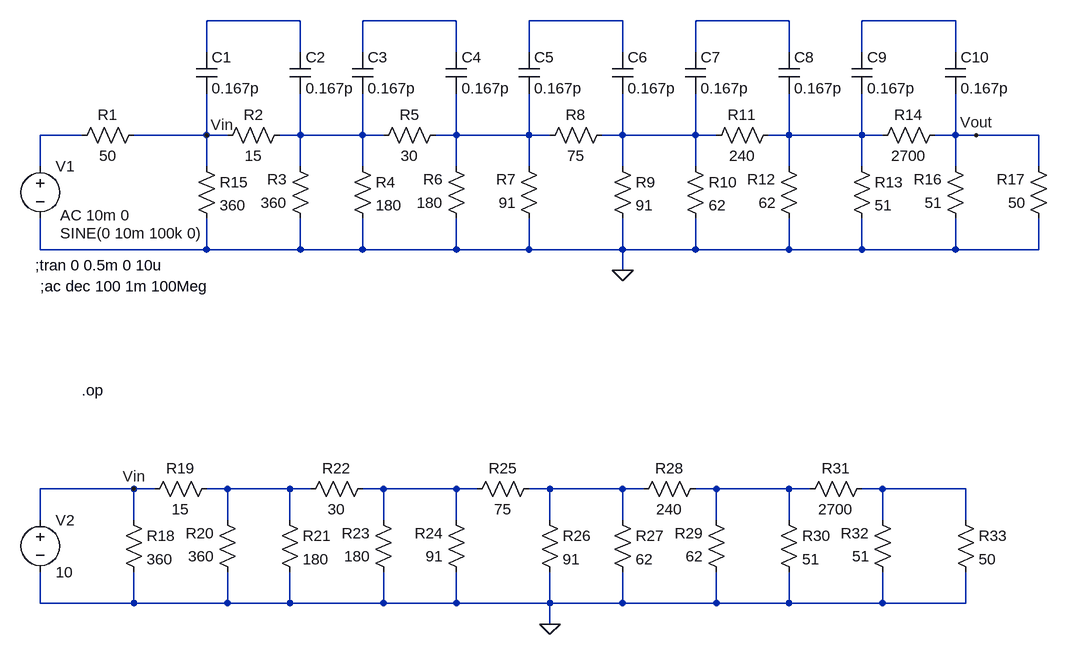
[diagram p0: schematic AttentuatorDesign.asc]
AttentuatorDesign.asc, the LTspice schematic file:
Version 4
SHEET 1 1624 980
WIRE 112 -80 -32 -80
WIRE 352 -80 208 -80
WIRE 608 -80 464 -80
WIRE 864 -80 720 -80
WIRE 1120 -80 976 -80
WIRE -32 -32 -32 -80
WIRE 112 -32 112 -80
WIRE 208 -32 208 -80
WIRE 352 -32 352 -80
WIRE 464 -32 464 -80
WIRE 608 -32 608 -80
WIRE 720 -32 720 -80
WIRE 864 -32 864 -80
WIRE 976 -32 976 -80
WIRE 1120 -32 1120 -80
WIRE -224 96 -288 96
WIRE -32 96 -32 32
WIRE -32 96 -144 96
WIRE 0 96 -32 96
WIRE 112 96 112 32
WIRE 112 96 80 96
WIRE 208 96 208 32
WIRE 208 96 112 96
WIRE 240 96 208 96
WIRE 352 96 352 32
WIRE 352 96 320 96
WIRE 464 96 464 32
WIRE 464 96 352 96
WIRE 496 96 464 96
WIRE 608 96 608 32
WIRE 608 96 576 96
WIRE 720 96 720 32
WIRE 720 96 608 96
WIRE 752 96 720 96
WIRE 864 96 864 32
WIRE 864 96 832 96
WIRE 976 96 976 32
WIRE 976 96 864 96
WIRE 1008 96 976 96
WIRE 1120 96 1120 32
WIRE 1120 96 1088 96
WIRE 1152 96 1120 96
WIRE 1248 96 1152 96
WIRE -288 144 -288 96
WIRE -32 144 -32 96
WIRE 112 144 112 96
WIRE 208 144 208 96
WIRE 352 144 352 96
WIRE 464 144 464 96
WIRE 608 144 608 96
WIRE 720 144 720 96
WIRE 864 144 864 96
WIRE 976 144 976 96
WIRE 1120 144 1120 96
WIRE 1248 144 1248 96
WIRE -288 272 -288 224
WIRE -32 272 -32 224
WIRE -32 272 -288 272
WIRE 112 272 112 224
WIRE 112 272 -32 272
WIRE 208 272 208 224
WIRE 208 272 112 272
WIRE 352 272 352 224
WIRE 352 272 208 272
WIRE 464 272 464 224
WIRE 464 272 352 272
WIRE 608 272 608 224
WIRE 608 272 464 272
WIRE 720 272 720 224
WIRE 720 272 608 272
WIRE 864 272 864 224
WIRE 864 272 720 272
WIRE 976 272 976 224
WIRE 976 272 864 272
WIRE 1120 272 1120 224
WIRE 1120 272 976 272
WIRE 1248 272 1248 224
WIRE 1248 272 1120 272
WIRE 608 304 608 272
WIRE -144 640 -288 640
WIRE -112 640 -144 640
WIRE 0 640 -32 640
WIRE 96 640 0 640
WIRE 128 640 96 640
WIRE 240 640 208 640
WIRE 352 640 240 640
WIRE 384 640 352 640
WIRE 496 640 464 640
WIRE 608 640 496 640
WIRE 640 640 608 640
WIRE 752 640 720 640
WIRE 864 640 752 640
WIRE 896 640 864 640
WIRE 1008 640 976 640
WIRE 1136 640 1008 640
WIRE -288 688 -288 640
WIRE -144 688 -144 640
WIRE 0 688 0 640
WIRE 96 688 96 640
WIRE 240 688 240 640
WIRE 352 688 352 640
WIRE 496 688 496 640
WIRE 608 688 608 640
WIRE 752 688 752 640
WIRE 864 688 864 640
WIRE 1008 688 1008 640
WIRE 1136 688 1136 640
WIRE -288 816 -288 768
WIRE -144 816 -144 768
WIRE -144 816 -288 816
WIRE 0 816 0 768
WIRE 0 816 -144 816
WIRE 96 816 96 768
WIRE 96 816 0 816
WIRE 240 816 240 768
WIRE 240 816 96 816
WIRE 352 816 352 768
WIRE 352 816 240 816
WIRE 496 816 496 768
WIRE 496 816 352 816
WIRE 608 816 608 768
WIRE 608 816 496 816
WIRE 752 816 752 768
WIRE 752 816 608 816
WIRE 864 816 864 768
WIRE 864 816 752 816
WIRE 1008 816 1008 768
WIRE 1008 816 864 816
WIRE 1136 816 1136 768
WIRE 1136 816 1008 816
WIRE 496 848 496 816
FLAG 496 848 0
FLAG -144 640 Vin
FLAG 1152 96 Vout
FLAG 608 304 0
FLAG -32 96 Vin
SYMBOL voltage -288 128 R0
WINDOW 3 31 119 Left 2
WINDOW 123 31 91 Left 2
WINDOW 39 0 0 Left 0
SYMATTR Value SINE(0 10m 100k 0)
SYMATTR Value2 AC 10m 0
SYMATTR InstName V1
SYMBOL res -128 80 R90
WINDOW 0 0 56 VBottom 2
WINDOW 3 32 56 VTop 2
SYMATTR InstName R1
SYMATTR Value 50
SYMBOL res 1264 240 R180
WINDOW 0 36 76 Left 2
WINDOW 3 36 40 Left 2
SYMATTR InstName R17
SYMATTR Value 50
SYMBOL res -160 672 R0
SYMATTR InstName R18
SYMATTR Value 360
SYMBOL res -16 624 R90
WINDOW 0 0 56 VBottom 2
WINDOW 3 32 56 VTop 2
SYMATTR InstName R19
SYMATTR Value 15
SYMBOL res 16 784 R180
WINDOW 0 36 76 Left 2
WINDOW 3 36 40 Left 2
SYMATTR InstName R20
SYMATTR Value 360
SYMBOL res 80 672 R0
SYMATTR InstName R21
SYMATTR Value 180
SYMBOL res 224 624 R90
WINDOW 0 0 56 VBottom 2
WINDOW 3 32 56 VTop 2
SYMATTR InstName R22
SYMATTR Value 30
SYMBOL res 256 784 R180
WINDOW 0 36 76 Left 2
WINDOW 3 36 40 Left 2
SYMATTR InstName R23
SYMATTR Value 180
SYMBOL res 368 784 R180
WINDOW 0 36 76 Left 2
WINDOW 3 36 40 Left 2
SYMATTR InstName R24
SYMATTR Value 91
SYMBOL res 368 656 R270
WINDOW 0 32 56 VTop 2
WINDOW 3 0 56 VBottom 2
SYMATTR InstName R25
SYMATTR Value 75
SYMBOL res 480 672 R0
SYMATTR InstName R26
SYMATTR Value 91
SYMBOL res 592 672 R0
SYMATTR InstName R27
SYMATTR Value 62
SYMBOL res 736 624 R90
WINDOW 0 0 56 VBottom 2
WINDOW 3 32 56 VTop 2
SYMATTR InstName R28
SYMATTR Value 240
SYMBOL res 768 784 R180
WINDOW 0 36 76 Left 2
WINDOW 3 36 40 Left 2
SYMATTR InstName R29
SYMATTR Value 62
SYMBOL res 848 672 R0
SYMATTR InstName R30
SYMATTR Value 51
SYMBOL res 992 624 R90
WINDOW 0 0 56 VBottom 2
WINDOW 3 32 56 VTop 2
SYMATTR InstName R31
SYMATTR Value 2700
SYMBOL res 1024 784 R180
WINDOW 0 36 76 Left 2
WINDOW 3 36 40 Left 2
SYMATTR InstName R32
SYMATTR Value 51
SYMBOL voltage -288 672 R0
WINDOW 123 0 0 Left 0
WINDOW 39 0 0 Left 0
SYMATTR InstName V2
SYMATTR Value 10
SYMBOL cap -48 -32 R0
SYMATTR InstName C1
SYMATTR Value 0.167p
SYMBOL cap 96 -32 R0
SYMATTR InstName C2
SYMATTR Value 0.167p
SYMBOL cap 192 -32 R0
SYMATTR InstName C3
SYMATTR Value 0.167p
SYMBOL cap 336 -32 R0
SYMATTR InstName C4
SYMATTR Value 0.167p
SYMBOL cap 448 -32 R0
SYMATTR InstName C5
SYMATTR Value 0.167p
SYMBOL cap 592 -32 R0
SYMATTR InstName C6
SYMATTR Value 0.167p
SYMBOL cap 704 -32 R0
SYMATTR InstName C7
SYMATTR Value 0.167p
SYMBOL cap 848 -32 R0
SYMATTR InstName C8
SYMATTR Value 0.167p
SYMBOL cap 960 -32 R0
SYMATTR InstName C9
SYMATTR Value 0.167p
SYMBOL cap 1104 -32 R0
SYMATTR InstName C10
SYMATTR Value 0.167p
SYMBOL res 1120 672 R0
SYMATTR InstName R33
SYMATTR Value 50
SYMBOL res 96 80 R90
WINDOW 0 0 56 VBottom 2
WINDOW 3 32 56 VTop 2
SYMATTR InstName R2
SYMATTR Value 15
SYMBOL res 128 240 R180
WINDOW 0 36 76 Left 2
WINDOW 3 36 40 Left 2
SYMATTR InstName R3
SYMATTR Value 360
SYMBOL res 192 128 R0
SYMATTR InstName R4
SYMATTR Value 180
SYMBOL res 336 80 R90
WINDOW 0 0 56 VBottom 2
WINDOW 3 32 56 VTop 2
SYMATTR InstName R5
SYMATTR Value 30
SYMBOL res 368 240 R180
WINDOW 0 36 76 Left 2
WINDOW 3 36 40 Left 2
SYMATTR InstName R6
SYMATTR Value 180
SYMBOL res 480 240 R180
WINDOW 0 36 76 Left 2
WINDOW 3 36 40 Left 2
SYMATTR InstName R7
SYMATTR Value 91
SYMBOL res 480 112 R270
WINDOW 0 32 56 VTop 2
WINDOW 3 0 56 VBottom 2
SYMATTR InstName R8
SYMATTR Value 75
SYMBOL res 592 128 R0
SYMATTR InstName R9
SYMATTR Value 91
SYMBOL res 704 128 R0
SYMATTR InstName R10
SYMATTR Value 62
SYMBOL res 848 80 R90
WINDOW 0 0 56 VBottom 2
WINDOW 3 32 56 VTop 2
SYMATTR InstName R11
SYMATTR Value 240
SYMBOL res 880 240 R180
WINDOW 0 36 76 Left 2
WINDOW 3 36 40 Left 2
SYMATTR InstName R12
SYMATTR Value 62
SYMBOL res 960 128 R0
SYMATTR InstName R13
SYMATTR Value 51
SYMBOL res 1104 80 R90
WINDOW 0 0 56 VBottom 2
WINDOW 3 32 56 VTop 2
SYMATTR InstName R14
SYMATTR Value 2700
SYMBOL res -48 128 R0
SYMATTR InstName R15
SYMATTR Value 360
SYMBOL res 1136 240 R180
WINDOW 0 36 76 Left 2
WINDOW 3 36 40 Left 2
SYMATTR InstName R16
SYMATTR Value 51
TEXT -296 296 Left 2 !;tran 0 0.5m 0 10u
TEXT -288 328 Left 2 !;ac dec 100 1m 100Meg
TEXT -224 488 Left 2 !.op

The netlist it stands for:
* AttentuatorDesign.asc
V1 N006 0 SINE(0 10m 100k 0) AC 10m 0
R1 Vin N006 50
R17 0 Vout 50
R18 Vin 0 360
R19 N011 Vin 15
R20 0 N011 360
R21 N011 0 180
R22 N012 N011 30
R23 0 N012 180
R24 0 N012 91
R25 N012 N013 75
R26 N013 0 91
R27 N013 0 62
R28 N014 N013 240
R29 0 N014 62
R30 N014 0 51
R31 N015 N014 2700
R32 0 N015 51
V2 Vin 0 10
C1 N001 Vin 0.167p
C2 N001 N007 0.167p
C3 N002 N007 0.167p
C4 N002 N008 0.167p
C5 N003 N008 0.167p
C6 N003 N009 0.167p
C7 N004 N009 0.167p
C8 N004 N010 0.167p
C9 N005 N010 0.167p
C10 N005 Vout 0.167p
R33 N015 0 50
R2 N007 Vin 15
R3 0 N007 360
R4 N007 0 180
R5 N008 N007 30
R6 0 N008 180
R7 0 N008 91
R8 N008 N009 75
R9 N009 0 91
R10 N009 0 62
R11 N010 N009 240
R12 0 N010 62
R13 N010 0 51
R14 Vout N010 2700
R15 Vin 0 360
R16 0 Vout 51
;tran 0 0.5m 0 10u
;ac dec 100 1m 100Meg
.op
.backanno
.end